# Altium schematic sheet MainPCB.SchDoc
size 431 x 279 mm; Organization: Machine Intelligence Laboratory; Address1: 571 Gale Lemerand Dr.; Address2: Suite #126; Address3: Gainesville, FL, 32611; SheetNumber: 1; SheetTotal: 1
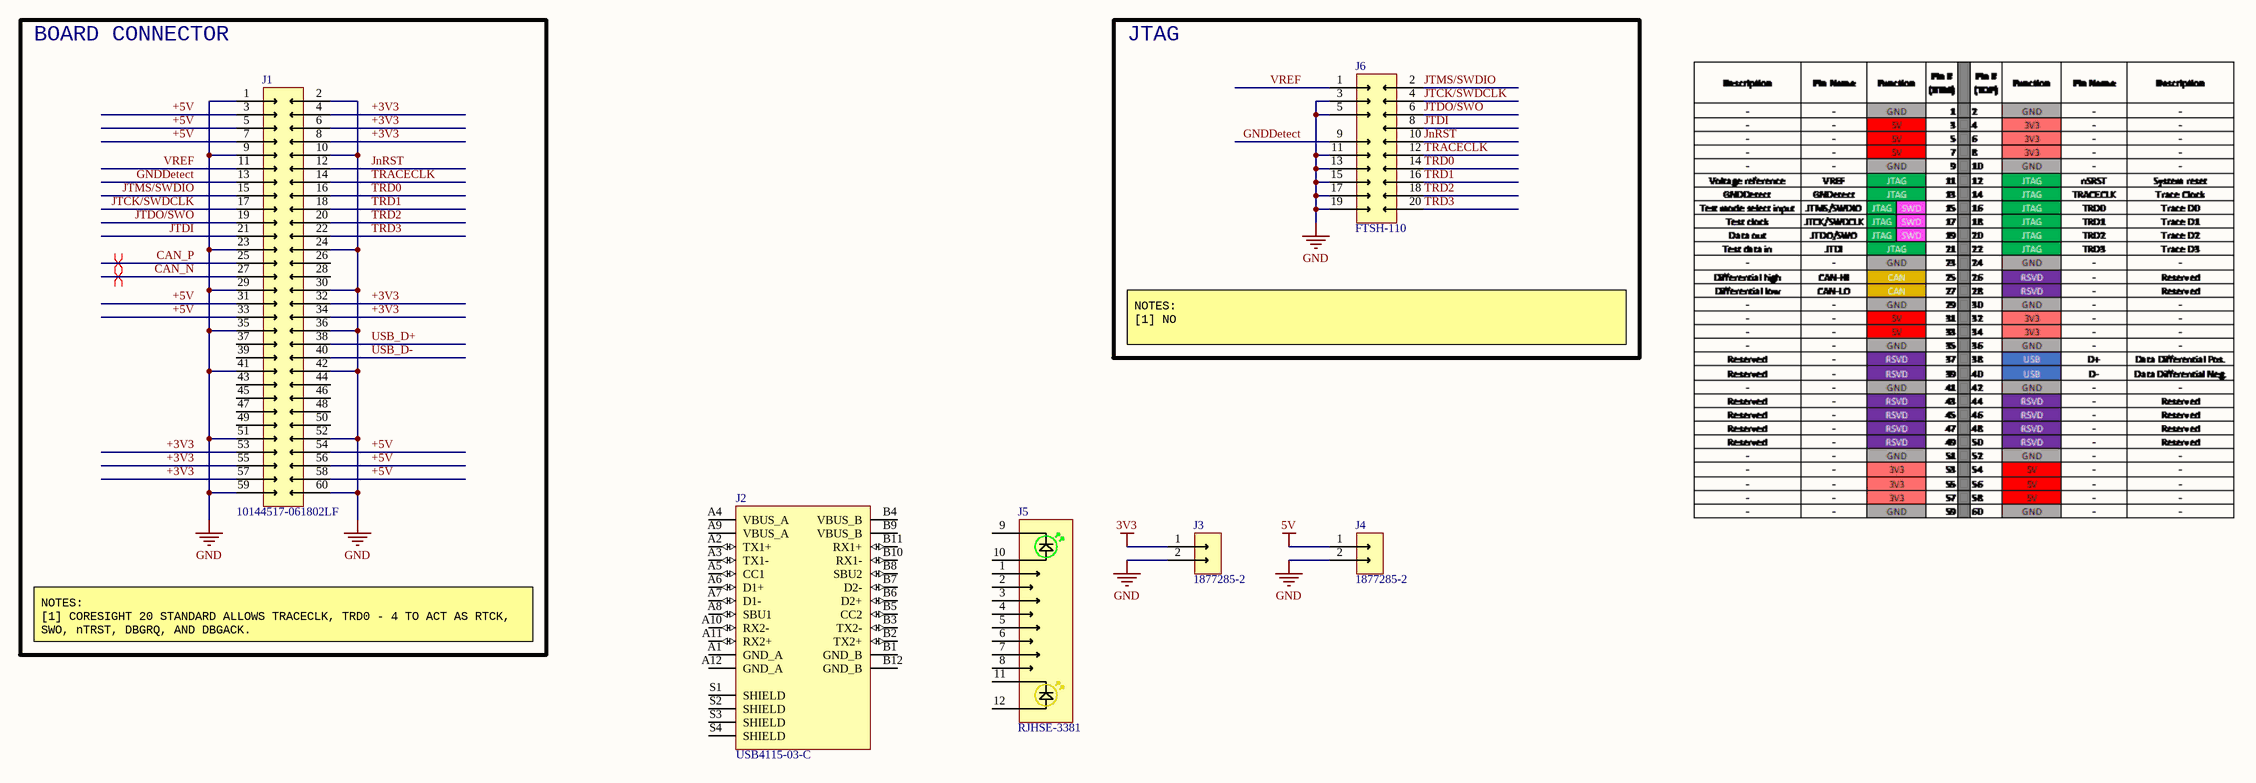
[diagram p0: MainPCB.SchDoc]

## Parts
J1  10144517-061802LF  [AMPHENOL_10144517-061802LF]
J2  USB4115-03-C  [GCT_USB4115-03-C_REVB2]
J3  1877285-2  [TE_1877285-2]
J4  1877285-2  [TE_1877285-2]
J5  RJHSE-3381  [AMPHENOL_RJHSE3381]
J6  FTSH-110  [SAMTEC_FTSH-110-01-L-DV-007]

## Blocks framed on the sheet
BOARD CONNECTOR: J1
JTAG: J6

## Nets
3V3: J3.1
5V: J4.1
GND: J1.1 J1.2 J1.9 J1.10 J1.23 J1.24 J1.29 J1.30 J1.35 J1.36 J1.41 J1.42 J1.51 J1.52 J1.59 J1.60 J3.2 J4.2 J6.3 J6.5 J6.11 J6.13 J6.15 J6.17 J6.19
+3V3: J1.4 J1.6 J1.8 J1.32 J1.34 J1.53 J1.55 J1.57
+5V: J1.3 J1.5 J1.7 J1.31 J1.33 J1.54 J1.56 J1.58
CAN_N: J1.27
CAN_P: J1.25
GNDDetect: J1.13 J6.9
JnRST: J1.12 J6.10
JTCK/SWDCLK: J1.17 J6.4
JTDI: J1.21 J6.8
JTDO/SWO: J1.19 J6.6
JTMS/SWDIO: J1.15 J6.2
TRACECLK: J1.14 J6.12
TRD0: J1.16 J6.14
TRD1: J1.18 J6.16
TRD2: J1.20 J6.18
TRD3: J1.22 J6.20
USB_D+: J1.38
USB_D-: J1.40
VREF: J1.11 J6.1

Not connected (* = marked no-connect by the designer): J1 26 28 37 39 43 44 45 46 47 48 49 50; J2 A1(GND_A) A2(TX1+) A3(TX1-) A4(VBUS_A) A5(CC1) A6(D1+) A7(D1-) A8(SBU1) A9(VBUS_A) A10(RX2-) A11(RX2+) A12(GND_A) B1(GND_B) B2(TX2+) B3(TX2-) B4(VBUS_B) B5(CC2) B6(D2+) B7(D2-) B8(SBU2) B9(VBUS_B) B10(RX1-) B11(RX1+) B12(GND_B) S1(SHIELD) S2(SHIELD) S3(SHIELD) S4(SHIELD); J5 1 2 3 4 5 6 7 8 9(G-) 10(G+) 11(Y-) 12(Y+)

## Layout directives
differential pair; rule Matched Net Lengths [Tolerance = 5mil]; rule Differential Pairs Routing [Pref Gap = 10mil    Min Gap  = 10mil    Max Gap  = 10milPref Width = 15mil    Min Width  = 15mil    Max Width  = 15mil]; net class CAN; differential pair class CAN_LINES: CAN_N, CAN_P

## Notes on the sheet
- NOTES:
  [1] NO
- NOTES:
  [1] CORESIGHT 20 STANDARD ALLOWS TRACECLK, TRD0 - 4 TO ACT AS RTCK, SWO, nTRST, DBGRQ, AND DBGACK.
- REVISION
- DESCRIPTION
- DATE
- APPROVED
- Project/Vehicle:
- Author(s):
- -
- Revisor(s):
- Git Repo:
- Git Hash:
- Date:
- Revision:
- Size:
- A
- File:
- Sheet
- of

## Library data of the parts
J1 = 10144517-061802LF: CONN RCPT 60POS SMD GOLD; Supplier 1: Digi-Key; Supplier Part Number 1: 609-5433-1-ND
J2 = USB4115-03-C: USB-C (USB TYPE-C) USB 3.2 Gen 2 (USB 3.1 Gen 2, Superspeed + (USB 3.1)) Receptacle Connector 24 Position Surface Mount, Through Hole; Supplier 1: Future Electronics; Supplier Part Number 1: 4134645
J5 = RJHSE-3381: Jack Modular Connector 8p8c (RJ45, Ethernet) Vertical Shielded; Supplier 1: Digi-Key; Supplier Part Number 1: RJHSE-3381-ND
J6 = FTSH-110-01-L-DV-007-K: Connector Header Surface Mount 20 position 0.050" (1.27mm); Supplier 1: Digi-Key; Supplier Part Number 1: SAM9456-ND
J3 J4 = 1877285-2: Supplier 1: Digi-Key; Supplier Part Number 1: A99845-ND